# EAGLE design Caravan Tracker (EAGLE 7.3.0)
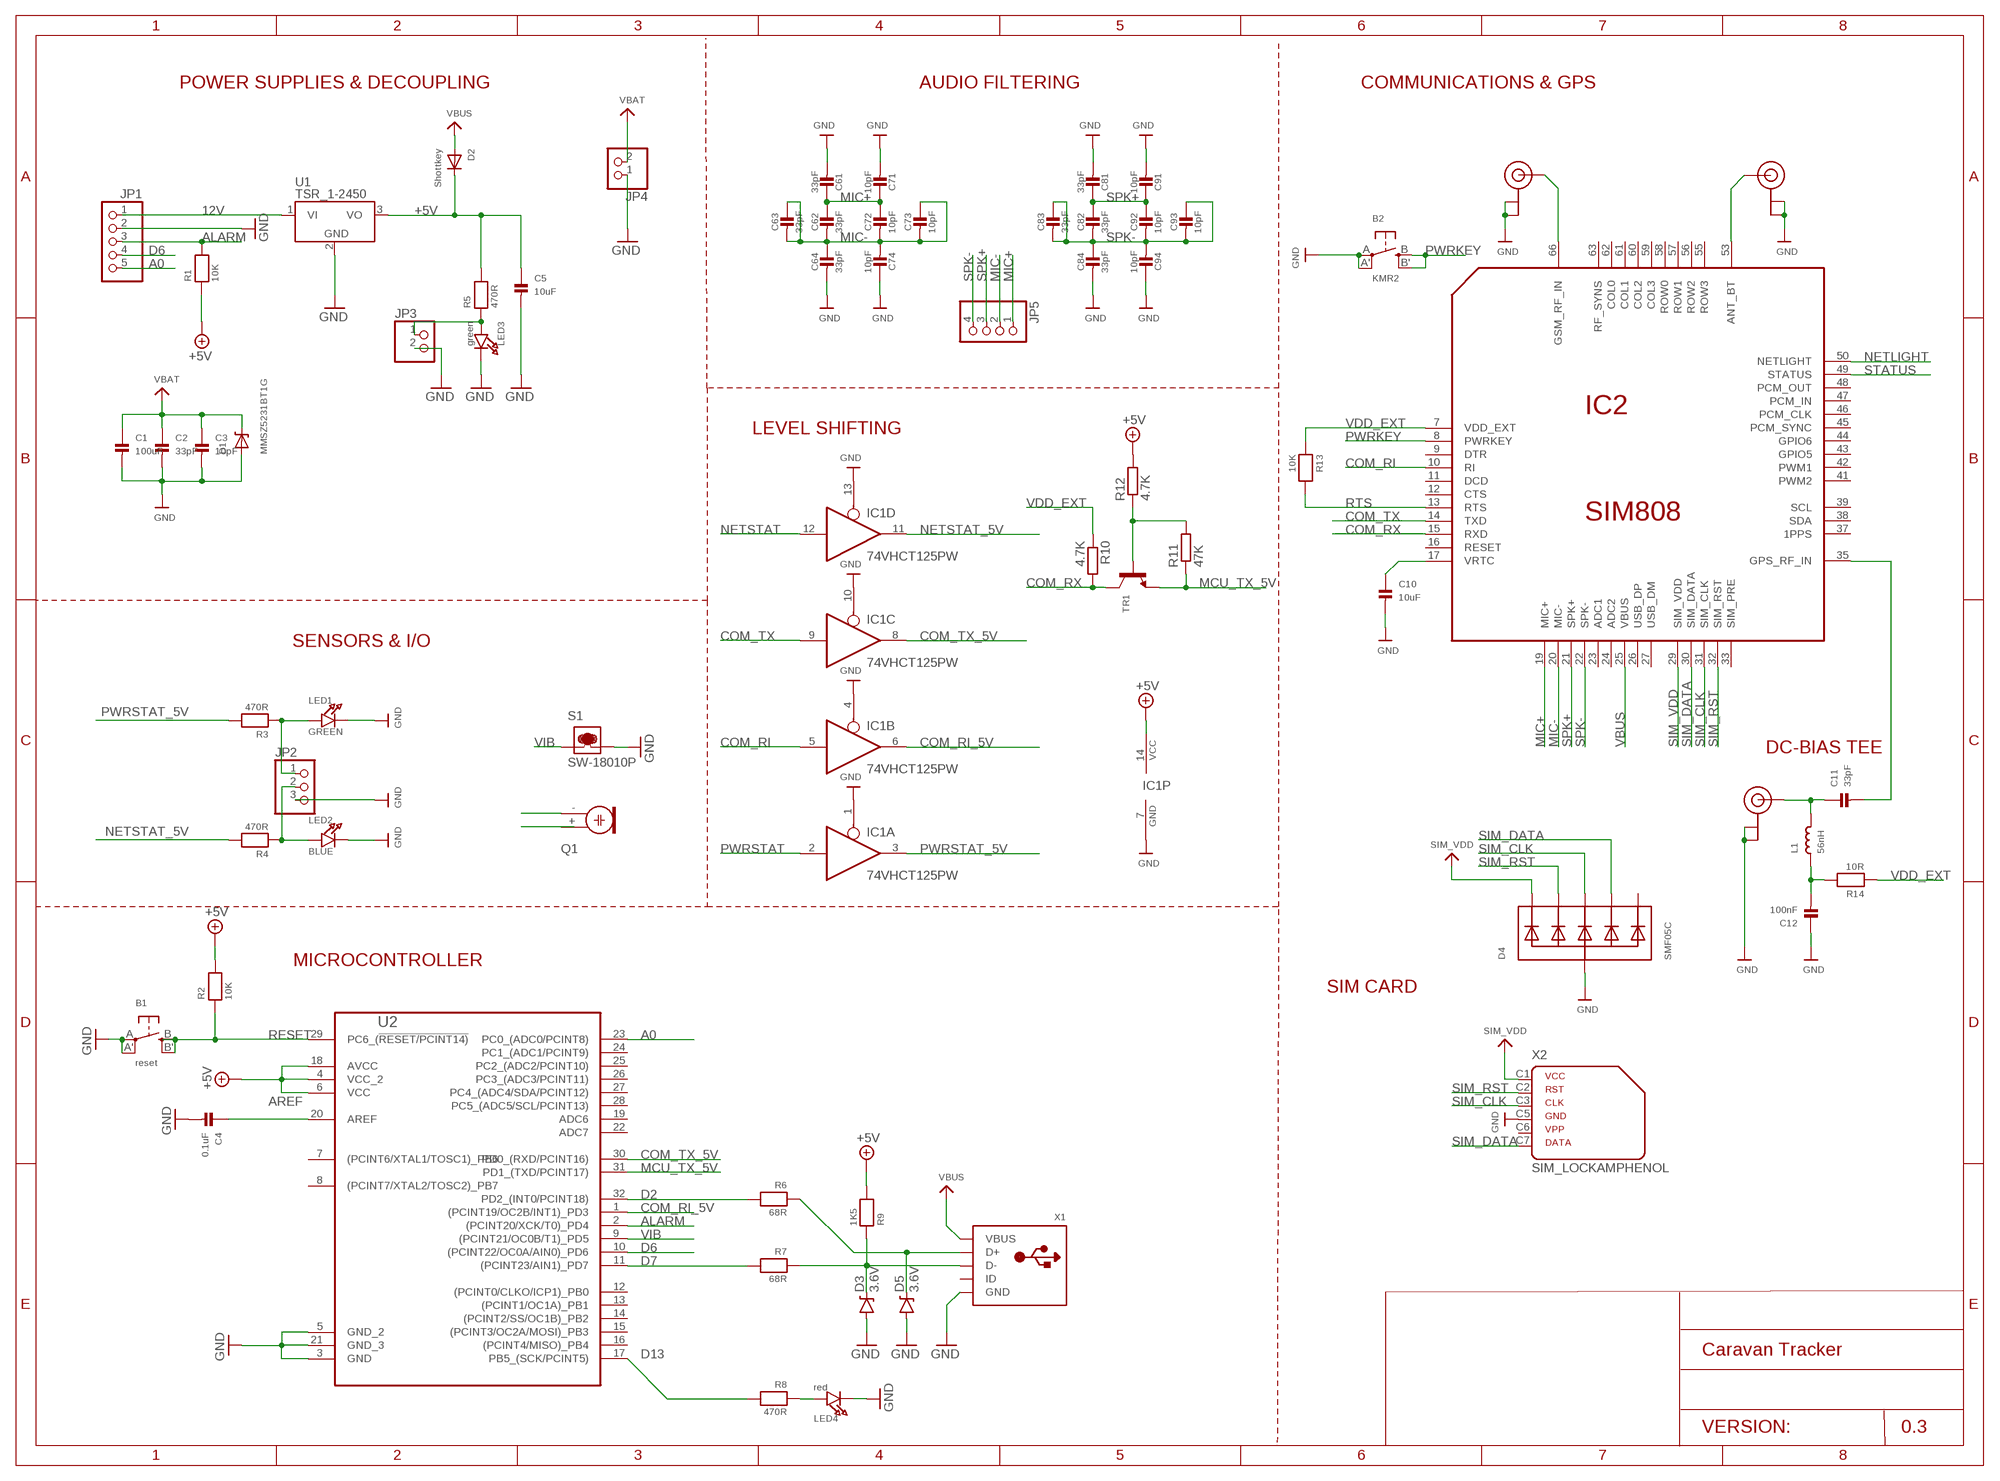
[diagram p0: schematic, sheet 1]

## Parts
B1  reset  SWITCH_TACT_SMT4.6X2.8  [BTN_KMR2_4.6X2.8]
B2  KMR2  SWITCH_TACT_SMT4.6X2.8  [BTN_KMR2_4.6X2.8]
C1  100uF  CAP_CERAMIC1206  [1206]
C2  33pF  CAP_CERAMIC0805  [0805]
C3  10pF  CAP_CERAMIC0805  [0805]
C4  0.1uF  CAP_CERAMIC0603  [0603]
C5  10uF  CAP_CERAMIC0603  [0603]
C6  33pF  CAP_4PACK1206  [RESPACK_4X0603]
C7  10pF  CAP_4PACK1206  [RESPACK_4X0603]
C8  33pF  CAP_4PACK1206  [RESPACK_4X0603]
C9  10pF  CAP_4PACK1206  [RESPACK_4X0603]
C10  10uF  CAP_CERAMIC0805  [0805]
C11  33pF  CAP_CERAMIC0805  [0805]
C12  100nF  CAP_CERAMIC0805  [0805]
D1  MMSZ5231BT1G  DIODE-ZENERSOD123  [SOD-123]
D2  Shottkey  DIODESOD-123  [SOD-123]
D3  3.6V  DIODE-ZENER3.3V  [SOD-323]
D4  SMF05C  TVSARRAY_5LANE  [SOT363]
D5  3.6V  DIODE-ZENER3.3V  [SOD-323]
IC1  74VHCT125PW  74ABT125PW  [TSSOP14]
IC2  SIM808  [SIM808]
JP1  HEADER-1X5ROUND  [1X05_ROUND]
JP2  HEADER-1X3ROUND  [1X03_ROUND]
JP3  HEADER-1X2ROUND  [1X02_ROUND]
JP4  JST_2PIN  [JSTPH2]
JP5  HEADER-1X4ROUND  [1X04_ROUND]
L1  56nH  INDUCTOR_0805  [_0805]
LED1  GREEN  LED0805_NOOUTLINE  [CHIPLED_0805_NOOUTLINE]
LED2  BLUE  LED0805_NOOUTLINE  [CHIPLED_0805_NOOUTLINE]
LED3  green  LED0805_NOOUTLINE  [CHIPLED_0805_NOOUTLINE]
LED4  red  LED0805_NOOUTLINE  [CHIPLED_0805_NOOUTLINE]
Q1  ELECTRET  [9.7ELECTRET]
R1  10K  RESISTOR0603  [0603]
R2  10K  RESISTOR0603  [0603]
R3  470R  RESISTOR0603  [0603]
R4  470R  RESISTOR0603  [0603]
R5  470R  RESISTOR0603  [0603]
R6  68R  RESISTOR0603  [0603]
R7  68R  RESISTOR0603  [0603]
R8  470R  RESISTOR0603  [0603]
R9  1K5  RESISTOR0603  [0603]
R10  4.7K  R-EU_R0603  [R0603]
R11  47K  R-EU_R0603  [R0603]
R12  4.7K  R-EU_R0603  [R0603]
R13  10K  RESISTOR0603  [0603]
R14  10R  RESISTOR_0805  [_0805]
S1  SW-18010P  [SW-18010P]
TR1  TRANSISTOR_NPN  [SOT23-R]
U1  TSR_1-2450  [TSR-1]
U2  ATMEGA328-AU  [QFP80P900X900X120-32N]
U$1  U.FL (GPS)  U.FL  [U.FL]
U$2  U.FL  [U.FL]
U$3  U.FL  [U.FL]
X1  USBMICRO_20329  [4UCONN_20329]
X2  SIM_LOCKAMPHENOL  [C707_10M006_512_2]

## Nets
12V [power]: JP1.1 U1.1(VI)
+5V [power]: C5.1 D2.C IC1.14(P:VCC) R1.1 R2.2 R5.2 R9.2 R12.2 U1.3(VO) U2.4(VCC_2) U2.6(VCC) U2.18(AVCC)
A0: JP1.5 U2.23(PC0_(ADC0/PCINT8))
ALARM: JP1.3 R1.2 U2.2((PCINT20/XCK/T0)_PD4)
ANT_BT: IC2.53(ANT_BT) U$3.3(SIGNAL)
AREF: C4.1 U2.20(AREF)
COM_RI: IC1.5(B:I) IC2.10(RI)
COM_RI_5V: IC1.6(B:O) U2.1((PCINT19/OC2B/INT1)_PD3)
COM_RX: IC2.15(RXD) R10.2 TR1.3(C)
COM_TX: IC1.9(C:I) IC2.14(TXD)
COM_TX_5V: IC1.8(C:O) U2.30(PD0_(RXD/PCINT16))
D2: R6.2 U2.32(PD2_(INT0/PCINT18))
D6: JP1.4 U2.10((PCINT22/OC0A/AIN0)_PD6)
D7: R7.2 U2.11((PCINT23/AIN1)_PD7)
D13: R8.2 U2.17(PB5_(SCK/PCINT5))
GND: B1.A'(P1) B1.A(P) B2.A'(P1) B2.A(P) C1.2 C2.2 C3.2 C4.2 C5.2 C6.5 C6.8 C7.4 C7.8 C8.5 C8.8 C9.4 C9.8 C10.2 C12.1 D1.A D3.A D4.2(A) D5.A IC1.1(A:OE) IC1.4(B:OE) IC1.7(P:GND) IC1.10(C:OE) IC1.13(D:OE) JP1.2 JP2.3 JP3.2 JP4.1 LED1.C LED2.C LED3.C LED4.C S1.1 U1.2(GND) U2.3(GND) U2.5(GND_2) U2.21(GND_3) U$1.1(GND) U$1.2(GND) U$2.1(GND) U$2.2(GND) U$3.1(GND) U$3.2(GND) X1.BASE@1(GND) X1.BASE@2(GND) X1.GND X1.SPRT@1(GND) X1.SPRT@2(GND) X1.SPRT@3(GND) X1.SPRT@4(GND) X2.C5
GSM_RF_IN: IC2.66(GSM_RF_IN) U$2.3(SIGNAL)
MCU_TX_5V: R11.1 TR1.2(E) U2.31(PD1_(TXD/PCINT17))
MIC+: C6.1 C6.2 C7.1 C7.2 IC2.19(MIC+) JP5.1
MIC-: C6.3 C6.4 C6.6 C6.7 C7.3 C7.5 C7.6 C7.7 IC2.20(MIC-) JP5.2 Q1.-
N$1: LED4.A R8.1
N$2: JP2.2 LED2.A R4.1
N$3: D5.C R6.1 X1.D+
N$4: JP2.1 LED1.A R3.1
N$5: D3.C R7.1 R9.1 X1.D-
N$6: JP3.1 LED3.A R5.1
N$7: C12.2 L1.1 R14.2
N$8: R11.2 R12.1 TR1.1(B)
N$9: C11.1 L1.2 U$1.3(SIGNAL)
N$10: C11.2 IC2.35(GPS_RF_IN)
N$11: C10.1 IC2.17(VRTC)
NETLIGHT: IC2.50(NETLIGHT)
NETSTAT: IC1.12(D:I)
NETSTAT_5V: IC1.11(D:O) R4.2
PWRKEY: B2.B'(S1) B2.B(S) IC2.8(PWRKEY)
PWRSTAT: IC1.2(A:I)
PWRSTAT_5V: IC1.3(A:O) R3.2
RESET: B1.B'(S1) B1.B(S) R2.1 U2.29(PC6_(!RESET/PCINT14))
RTS: IC2.13(RTS) R13.2
SIM_CLK: D4.4(C3) IC2.31(SIM_CLK) X2.C3
SIM_DATA: D4.5(C4) IC2.30(SIM_DATA) X2.C7
SIM_RST: D4.3(C2) IC2.32(SIM_RST) X2.C2
SIM_VDD [power]: D4.1(C1) IC2.29(SIM_VDD) X2.C1
SPK+: C8.1 C8.2 C9.1 C9.2 IC2.21(SPK+) JP5.3
SPK-: C8.3 C8.4 C8.6 C8.7 C9.3 C9.5 C9.6 C9.7 IC2.22(SPK-) JP5.4
STATUS: IC2.49(STATUS)
VBAT [power]: C1.1 C2.1 C3.1 D1.C JP4.2
VBUS [power]: D2.A IC2.25(VBUS) X1.VBUS
VDD_EXT [power]: IC2.7(VDD_EXT) R10.1 R13.1 R14.1
VIB: S1.2 U2.9((PCINT21/OC0B/T1)_PD5)
Unconnected: D4.6(C5) IC2.9(DTR) IC2.11(DCD) IC2.12(CTS) IC2.16(RESET) IC2.23(ADC1) IC2.24(ADC2) IC2.26(USB_DP) IC2.27(USB_DM) IC2.33(SIM_PRE) IC2.37(1PPS) IC2.38(SDA) IC2.39(SCL) IC2.41(PWM2) IC2.42(PWM1) IC2.43(GPIO5) IC2.44(GPIO6) IC2.45(PCM_SYNC) IC2.46(PCM_CLK) IC2.47(PCM_IN) IC2.48(PCM_OUT) IC2.55(ROW3) IC2.56(ROW2) IC2.57(ROW1) IC2.58(ROW0) IC2.59(COL3) IC2.60(COL2) IC2.61(COL1) IC2.62(COL0) IC2.63(RF_SYNS) Q1.+ U2.7((PCINT6/XTAL1/TOSC1)_PB6) U2.8((PCINT7/XTAL2/TOSC2)_PB7) U2.12((PCINT0/CLKO/ICP1)_PB0) U2.13((PCINT1/OC1A)_PB1) U2.14((PCINT2/SS/OC1B)_PB2) U2.15((PCINT3/OC2A/MOSI)_PB3) U2.16((PCINT4/MISO)_PB4) U2.19(ADC6) U2.22(ADC7) U2.24(PC1_(ADC1/PCINT9)) U2.25(PC2_(ADC2/PCINT10)) U2.26(PC3_(ADC3/PCINT11)) U2.27(PC4_(ADC4/SDA/PCINT12)) U2.28(PC5_(ADC5/SCL/PCINT13)) X1.ID X2.C6

## Notes on the sheet
- POWER SUPPLIES & DECOUPLING | AUDIO FILTERING | COMMUNICATIONS & GPS
- LEVEL SHIFTING
- SENSORS & I/O
- DC-BIAS TEE
- MICROCONTROLLER
- SIM CARD
- VERSION: | 0.3

## Power pins joined to a net without a drawn wire
GND: IC2.1(GND) IC2.2(GND) IC2.3(GND) IC2.18(GND) IC2.28(GND) IC2.34(GND) IC2.36(GND) IC2.40(GND) IC2.51(GND) IC2.52(GND) IC2.54(GND) IC2.64(GND) IC2.65(GND) IC2.67(GND) IC2.68(GND)
VBAT: IC2.4(VBAT) IC2.5(VBAT) IC2.6(VBAT)

## Library data of the parts
B1 B2 = microbuilder:SWITCH_TACT_SMT: SMT Tact Switches 6x6mm - Digikey: P12940SCT-ND KMR2 (4.6x2.8mm) - Digikey: 401-1426-1-ND EVQ-PQHB55 - Light Touch, 160GF (4.5x4.5mm) - Digikey: P8090SCT-ND
C1-C5 C10-C12 = microbuilder:CAP_CERAMIC: Ceramic Capacitors 0402 - 0402 Surface Mount Capacitors 16pF 50V 5% [Digikey: 445-4899-2-ND] 18pF 50V 5% [Digikey: 490-1281-2-ND] 22pF 50V 5% [Digikey: 490-1283-2-ND] 68pF 50V 5% [Digikey: 490-1289-2-ND] 0.1uF 10V 10% [Digikey: 490-1318-2-ND] 1.0uF 6.3V 10% [Digikey: 490-1320-2-ND] 0603 - 0603 Surface Mount Capacitors 16 pF 50V 5% [Digikey: 445-5051-2-ND] 22 pF 50V [Digikey: PCC220ACVTR-ND] 33 pF 50V 5% [Digikey: 490-1415-1-ND] 56pF 50V 5% [Digikey: 490-1421-1-ND] 220pF 50V 5% [Digikey: 445-1285-1-ND] 680 pF 50V 2200 pF 50V 5% C0G [Digikey: 445-1297-1-ND] 5600 pF 100V 5% X7R [Digikey: 478-3711-1-ND] 0.1 µF 25V 10% [Digikey: PCC2277TR-ND] 0.22 µF 16V 10% X7R [Digikey: 445-1318-1-ND] 1.0 µF 25V 10% [Digikey: 445-5146-2-ND] 0603 - RF Specific 3pF 250V +/-0.1pF RF [Digikey: 712-1347-1-ND] 18 pF 250V 5% [Digikey: 478-3505-1-ND or 712-1322-1-ND] 56 pF 250V 5% C0G RF [Digikey: 490-4867-1-ND] 68 pF 250V RF [Digikey: 490-4868-1-ND] 0805 - 0805 Surface Mount Capacitors 220 pF 250V 2% RF Ceramic Capacitor [Digikey: 712-1398-1-ND] 1000 pF 50V 2% NP0 Ceramic Capacitor [Digikey: 478-3760-1-ND] 0.1 µF 25V 10% Ceramic Capacitor [Digikey: PCC1828TR-ND] 1.0 µF 16V 10% Ceramic Capacitor[Digikey: 490-1691-2-ND] 10.0 µF 10V 10% Ceramic Capacitor[Digikey: 709-1228-1-ND] 10.0 uF 16V 10% Ceramic Capacitor [Digikey: 478-5165-2-ND] 47 uF 6.3V 20% Ceramic Capacitor [Digikey: 587-1779-1-ND or 399-5506-1-ND] 1206 - 1206 Surface Mount Capacitors 47uF 10V 20% Ceramic Capacitor [Digikey: 490-5528-1-ND or 399-5508-1-ND or 445-6010-1-ND] 100uF 6.3V -20%, +80% Y5V Ceramic Capacitor (Digikey: 490-4512-1-ND, Mouser: 81-GRM31CF50J107ZE1L)
C6-C9 = microbuilder:CAP_4PACK
D1 = Adafruit-FONA-800-GSM-Breakout:DIODE-ZENER: Zener Diode
D2 = microbuilder:DIODE: Diode SMA Model Volts Amps Type Vf Vr Digikey # Notes SSA34-E3 40V 3A Schottky 480mV @ 3A 200uA @ 40V SSA34-E3/61TGITR-ND CDBA120-G 20V 1A Schottky 500mV @ 1A 500uA @ 20V 641-1014-6-ND REEL MBRA210 10V 2A Schottky 350mV @ 2A 700uA @ 10V MBRA210LT3 SOD-123 Model Volts Amps Type Vf Vr Order # Notes BAT54T1G 30V 200mA Schottky 800mV @ 200mA 2uA @ 25V BAT54T1GOSTR-ND B0530W 30V 500mA Schottky 430mV @ 500mA 130uA @ 30V B0530W-FDICT-ND REEL MBR120 1A 20V Schottky 340mV @ 1A MBR120VLSFT1GOSCT-ND SOD-323 Model Volts Amps Type Vf Vr Order # Notes PMEG2005EJ 20V 500mA Schottky 355mV @ 500mA 568-4110-1-ND ZLLS410 10V 570mA Schottky 380mV @ 570mA ZLLS410CT-ND 1N4148WS 75V 150mA Silicon/Simple 1V 1N4148WSFSCT-ND REEL SOD-523 Model Volts Amps Type Vf Vr Order # Notes BAT54XV2 30V 200mA Schottky 0.8V @ 100mA BAT54XV2CT-ND TB751S 30V 30mA Schottky RB751S-40TE61CT-ND SOT23-R/W (R = Solder Paste/Reflow Ovens, W = Hand-Soldering) Model Volts Amps Type Vf Vr Order # Notes BAT54FILM 40V 300mA Schottky 497-7162-1-ND
D3 D5 = SparkFun-DiscreteSemi:DIODE-ZENER: Zener Diode; PROD_ID: DIO-11284; VALUE: 3.3V
D4 = microbuilder:TVSARRAY_5LANE: Voltage Transient Suppressor Array SOT363 SMF05C - 100W 5V: Digikey - SMF05CT1GOSCT-ND
IC1 = 74xx-us:74*125: Quad bus BUFFER, 3-state
IC2 = sim808:SIM808
JP1 = microbuilder:HEADER-1X5: PIN HEADER
JP2 = microbuilder:HEADER-1X3: PIN HEADER
JP3 = microbuilder:HEADER-1X2: PIN HEADER
JP4 = microbuilder:JST_2PIN: JST 2-Pin Right-Angle Connector PH-Series - 4UConnector: 17311 SH-Series - 4UConnector: 07278
JP5 = microbuilder:HEADER-1X4: PIN HEADER
L1 = microbuilder:INDUCTOR: Inductors 0603: 10nH Ceramic Inductor - microwire antenna/RF (Digikey: 712-1434-2-ND) 0805: 560nH Ceramic Inductor - RF (Digikey: 553-1047-1-ND) 270nH Ceramic Inductor - Q = 40@250MHz, +-5%, 1 Ohm DC Resistance (Digikey: 535-10506-2-ND) 1007 (2518 Metric) SMT: 10µH 10% 250mOhm 820mA 1007 Inductor (Digikey: 587-2189-1-ND) 22µH 10% 500mOhm 580mA 1007 Inductor (Digikey: 587-2190-1-ND) 47µH 10% 950mOhm 420mA 1007 Inductor (Digikey: 587-2191-1-ND) 47µH 5% 100mOhm 1A 1008 Inductor (Digikey: 732-1816-1-ND) 5.0x5.0mm (Taiyo Yuden NR5040 Series) 6.8µH 20% 2.3A 64mOhm Inductor (Digikey: 587-2374-2-ND) 5.0x5.0mm (TDK VLC5045 Series) 4.7µH 20% 3.3A 34mOhm Inductor (Digikey: 445-6526-1-ND) 6.8µH 20% 2.7A 46mOhm Inductor (Digikey: 445-6527-1-ND) 6.0x6.0mm (TDK VLC6045 Series) 4.7µH 20% 3.8A 27mOhm Inductor (Digikey: 445-6538-2-ND) 6.8µH 20% 3A 41mOhm Inductor (Digikey: 445-6540-1-ND) 6.2µH 30% 2.2A 45mOhm Inductor (Digikey: SRR5028-6R2YCT-ND) - Not TDK VLC6045 but footprint should match 6.0x6.0mm (TDK SLF6045 Series) 6.8uH 30% 2A 33mOhm Inductor (Digikey: 445-4572-1-ND, Mouser: 810-SLF645T6R8N2R0PF)
LED1-LED4 = microbuilder:LED: LED 0603 - 0603 Surface Mount Package 2mA: Green LED - Low Power (3.9mcd, 2ma, 1.7Vf) - Digikey: 475-2709-2-ND Orange LED - Low Power (9.8mcd, 2ma, 1.8Vf) - Digikey: 475-1194-2-ND Red LED - Low Power (5mcd, 2ma, 1.8Vf) - Digikey: 475-1195-2-ND Yellow LED - Low Power (7mcd, 2ma, 1.8Vf) - Digikey: 475-1196-2-ND 5mA: Blue LED - Low Power (17mcd, 5ma, 2.9Vf) - Digikey: LNJ937W8CRACT-ND 0805 - 0805 Surface Mount Package 2mA: Red LED (8.8mcd, 2mA, 1.8Vf, Clear) - Low Power [Digikey: 475-2510-1-ND] Green LED (5mcd, 2mA, 1.8Vf, Clear) - Low Power [Digikey: 475-2730-1-ND] Yellow LED (11.3mcd, 2mA, 1.8Vf, Clear) - Low Power [Digikey: 475-2555-1-ND] 20mA: Red LED (104mcd, 20mA, Diffused) - LS R976 [Digikey: 475-1278-6-ND] Red LED (12mcd, 20mA, 2.0Vf, Clear) - APT2012EC [Digikey: 754-1128-1-ND] Green LED (15mcd, 20mA, 2.2Vf, Clear) - APT2012GC [Digikey: 754-1131-1-ND] Orange LED (160mcd, 20mA, 2.1Vf, Clear) - APT2012SECK [Digikey: 754-1130-1-ND] 1206 - 1206 Surface Mount Package Green LED (26mcd, 20mA, Diffused) - LG N971 [Digikey: 475-1407-6-ND] Red LED (15mcd, 20mA, Diffused) - LH N974 [Digikey: 475-1416-6-ND]
Q1 = Caravan Tracker:ELECTRET: Electret microphone Thru hole 2.54mm spacing with 9.7mm diameter
R1-R9 R13 R14 = microbuilder:RESISTOR: Resistors 0402 - 0402 Surface Mount Package 22 Ohm 1% 1/16W [Digikey: 311-22.0LRTR-ND] 33 Ohm 5% 1/16W 1.0K 5% 1/16W 1.5K 5% 1/16W 2.0K 1% 1/16W 10.0K 1% 1/16W [Digikey: 311-10.0KLRTR-ND] 10.0K 5% 1/16W [Digikey: RMCF0402JT10K0TR-ND] 12.1K 1% 1/16W [Digikey: 311-22.0LRTR-ND] 100.0K 5% 1/16W 0603 - 0603 Surface Mount Package 0 Ohm 1/10 Watt 1% Resistor 15 Ohm 1/10 Watt 1% Resistor 33 Ohm 1/10 Watt 1% Resistor 49.9 Ohm 1/10 Watt 1% Resistor 100 Ohm 1/10 Watt 1% Resistor 150 Ohm 1/10 Watt 1% Resistor 240 Ohm 1/10 Watt 1% Resistor 390 Ohm 1/10 Watt 1% Resistor 560 Ohm 1/10 Watt 1% Resistor 680 Ohm 1/10 Watt 1% Resistor 750 Ohm 1/10 Watt 1% Resistor 1.0K Ohm 1/10 Watt 1% Resistor 1.5K Ohm 1/10 Watt 1% Resistor 2.0K Ohm 1/10 Watt 1% Resistor 2.2K Ohm 1/10 Watt 1% Resistor 3.3K Ohm 1/10 Watt 1% Resistor 4.7K Ohm 1/10 Watt 1% Resistor 10.0K Ohm 1/10 Watt 1% Resistor 12.0K Ohm 1/10 Watt 1% Resistor 12.1K Ohm 1/10 Watt 1% Resistor 20.0K Ohm 1/10 Watt 1% Resistor 33.0K Ohm 1/10 Watt 1% Resistor 100.0K Ohm 1/10 Watt 1% Resistor 0805 - 0805 Surface Mount Package 0 Ohm 1/8 Watt 1% Resistor 33 Ohm 1/8 Watt 1% Resistor 100 Ohm 1/8 Watt 1% Resistor 150 Ohm 1/8 Watt 1% Resistor 200 Ohm 1/8 Watt 1% Resistor 240 Ohm 1/8 Watt 1% Resistor 330 Ohm 1/8 Watt 1% Resistor 390 Ohm 1/8 Watt 1% Resistor 470 Ohm 1/8 Watt 1% Resistor 1.0K Ohm 1/8 Watt 1% Resistor 1.5K Ohm 1/8 Watt 1% Resistor 2.0K Ohm 1/8 Watt 1% Resistor 4.7K Ohm 1/8 Watt 1% Resistor 5.1K Ohm 1/8 Watt 1% Resistor 5.6K Ohm 1/8 Watt 1% Resistor 10.0K Ohm 1/8 Watt 1% Resistor 22.0K Ohm 1/8 Watt 1% Resistor 33.0K Ohm 1/8 Watt 1% Resistor 100K Ohm 1/8 Watt 1% Resistor 1206 - 1206 Surface Mount Package 2012 - 2010 Surface Mount Package 0.11 Ohm 1/2 Watt 1% Resistor - Digikey: RHM.11UCT-ND
R10-R12 = resistor:R-EU_: RESISTOR, European symbol
S1 = Caravan Tracker:SW-18010P
TR1 = microbuilder:TRANSISTOR_NPN: NPN Transistor Transistor (NPN) 500mA 45V - BC817 [Digikey: 568-1631-1-ND] Transistor (NPN) 500mA 45V - BC817,215 [Mouser: 771-BC817-T/R] SOT23-R - SOT23 footprint optimised for use with solder paste and reflow ovens. SOT23-W - SOT23 footprint optimised for hand-soldering (larger pads).
U1 = _traco_tsr-1:TSR_1-*: TRACO TSR-1 Series Point-of-Load DC/DC-Converters Vi max. 36 V; Vo = (1.2 .. 15)V ±2%; Io = 0 .. 1 A SIP-Package (drop-in replacement for 78xx linear voltage regulators in TO220-package, vertically assembled) Source: www.tracopower.com Technologies: TSR 1- Vi (V) Vo (V) ±2% Io = 0 .. 1 A 24_ ( generic ) 2412 4.6 .. 36 1.2 2415 4.6 .. 36 1.5 2418 4.6 .. 36 1.8 2425 4.6 .. 36 2.5 2433 4.75.. 36 3.3 2450 6.5 .. 36 5.0 2465 9.0 .. 36 6.5 2490 12 .. 36 9.0 24120 15 .. 36 12 24150 18 .. 36 15 Author: Dipl.-Ing. FH Rainer Bayer HHN Hochschule Heilbronn, rainer.bayer@hs-heilbronn.de Ingenieurbüro ing-rb, mail@ing-rb.de
U2 = ATMEGA328-AU:ATMEGA328-AU: MCU, 8BIT, AVR, 32K FLASH, TQFP-32; MPN: ATMEGA328-AU; OC_FARNELL: 1972086; OC_NEWARK: 68T2926; PACKAGE: TQFP-32; SUPPLIER: ATMEL
U$1-U$3 = microbuilder:U.FL: U.FL Antenna Connector
X1 = usb:USB: USB Connectors USBMINIB - Surface Mount Female Mini-B USB Connector 4UConnector: 06564
X2 = microbuilder:SIM_LOCK: C707A SIMLOCK® 2.5 mm with wide solder tails Source: Data sheet <http://www.amphenol.info/downloads/C707_10M006_512_2.pdf>; OC_FARNELL: unknown; OC_NEWARK: unknown

## Net classes
1 power: width 0.356 mm

## Board
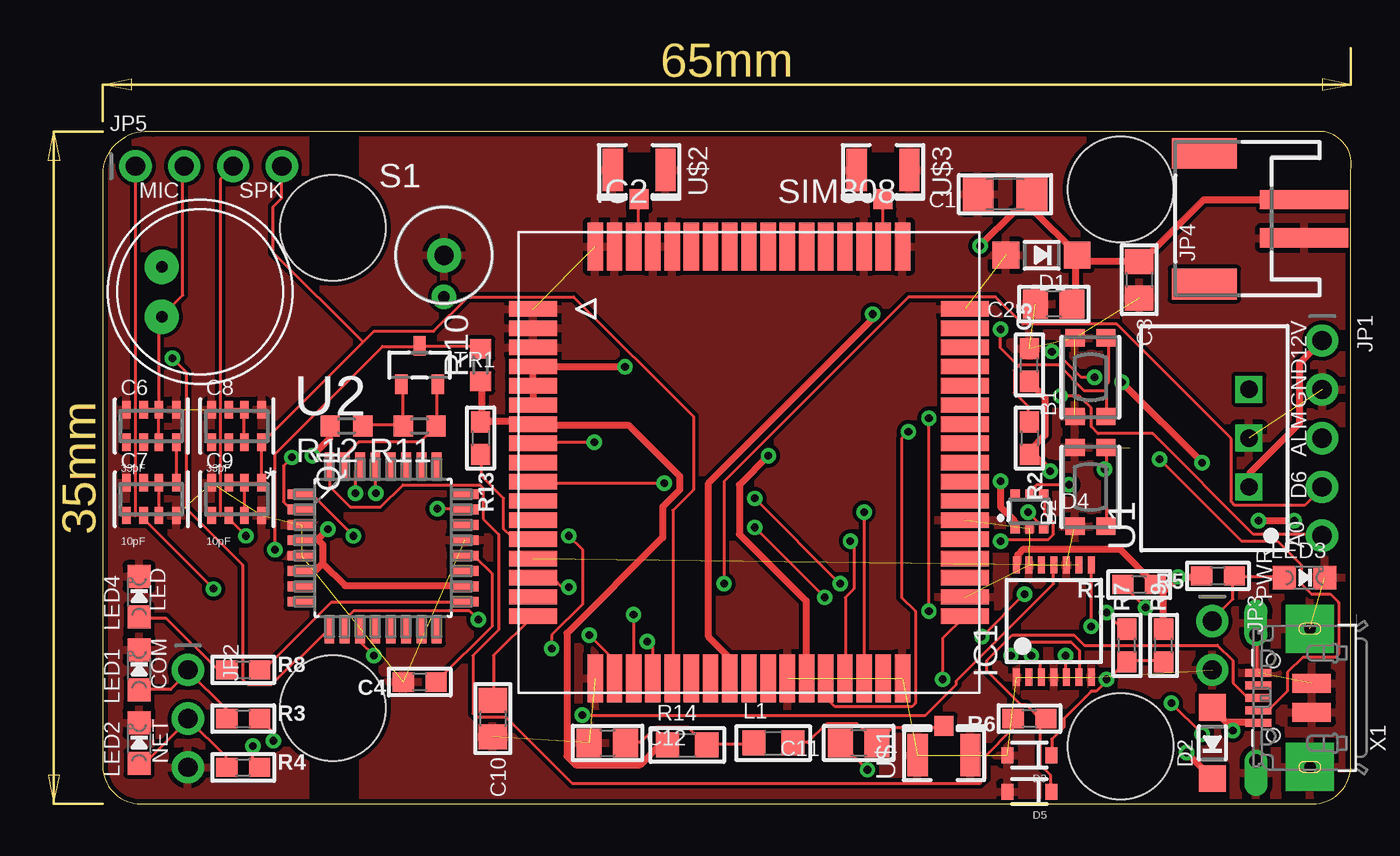
[diagram p1: board, top side]
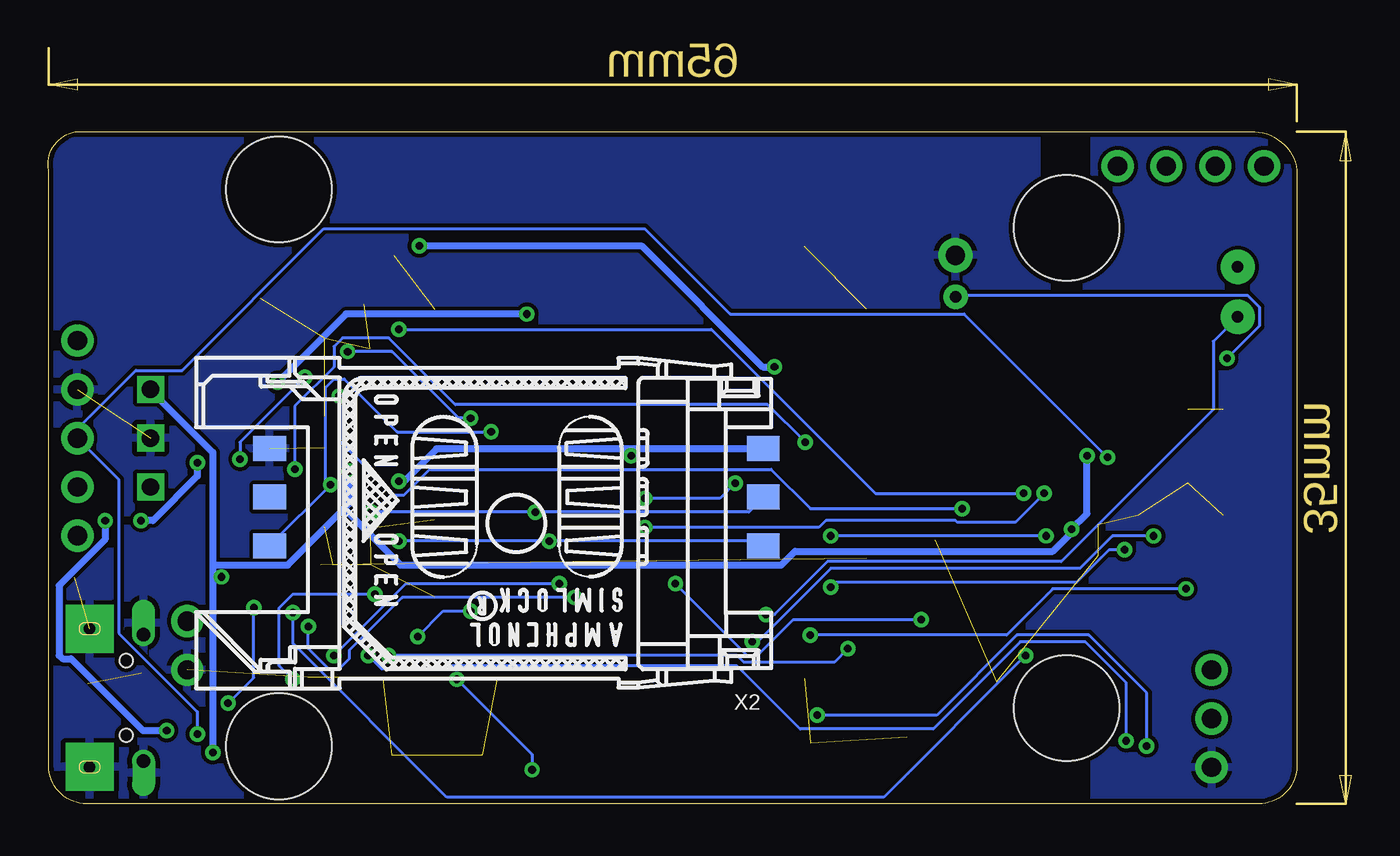
[diagram p2: board, bottom side, seen from below]

Size 65.03 x 35.02 mm. Coordinates in mm from the lower left corner, seen from the top.
Outline: 65,2 65,33 arc90 63.63,35 2.63,35 arc90 0,33 0,2 arc90 2,0 63,0 arc90 65,2
Copper layers (1*16): Top 0.035mm / dielectric 1.5mm / Bottom 0.035mm
Design rules "adafruit *": minimum track width 6mil, minimum drill 15.5mil, track to track 8mil, track to pad 5mil, pad to pad 8mil, via to via 8mil, smd to smd 8mil, copper to edge 10mil, drill to drill 8mil, minimum pad ring 10mil, minimum via ring 8mil, stop-mask expansion 2mil, vias tented up to drill 20mil, thermal gap 10mil
Holes 5.5 mm at 12,5 53,3 53,32 12,30
tKeepout: area 51,30 to 55,34; area 51,1 to 55,5; area 10.8,32.4 to 13.3,34.9; area 10.8,0 to 13.3,2.5
bKeepout: area 10.8,32.4 to 13.3,34.9; area 10.8,0 to 13.3,2.5
tRestrict: area 10.8,32.4 to 13.3,34.9; area 10.8,0 to 13.3,2.5
bRestrict: area 10.8,32.4 to 13.3,34.9; area 10.8,0 to 13.3,2.5
vRestrict: area 10.8,32.4 to 13.3,34.9; area 10.8,0 to 13.3,2.5

### Footprints (pad centres in the part's own frame; a part is rotated, then mirrored left to right if it is on the bottom)
BTN_KMR2_4.6X2.8 = smd 0.9 x 1: A 2.05,0.8; A' -2.05,0.8; B 2.05,-0.8; B' -2.05,-0.8
1206 = smd 1.6 x 1.8: 1 -1.4,0; 2 1.4,0
0805 = smd 1.3 x 1.5: 1 -0.95,0; 2 0.95,0
0603 = smd 1.1 x 1: 1 -0.85,0; 2 0.85,0
RESPACK_4X0603 = smd 0.45 x 0.9: 1 -1.3,-0.85; 2 -0.4,-0.85; 3 0.4,-0.85; 4 1.3,-0.85; 5 1.3,0.85; 6 0.4,0.85; 7 -0.4,0.85; 8 -1.3,0.85
SOD-123 = smd 1.4 x 1.4: A 1.85,0; C -1.85,0
SOD-323 = smd 0.63 x 0.83: A 1.15,0; C -1.15,0
SOT363 = smd 0.5 x 0.5: 1 -0.75,-0.9; 3 0.75,-0.9; 4 0.75,0.9; 6 -0.75,0.9 | smd 0.4 x 0.5: 2 0,-0.9; 5 0,0.9
TSSOP14 = smd 0.35 x 0.9: 1 -1.95,-2.925; 2 -1.3,-2.925; 3 -0.65,-2.925; 4 0,-2.925; 5 0.65,-2.925; 6 1.3,-2.925; 7 1.95,-2.925; 8 1.95,2.925; 9 1.3,2.925; 10 0.65,2.925; 11 0,2.925; 12 -0.65,2.925; 13 -1.3,2.925; 14 -1.95,2.925
SIM808 = smd 2.5 x 0.8: 1 -11.25,8; 2 -11.25,7; 3 -11.25,6; 4 -11.25,5; 5 -11.25,4; 6 -11.25,3; 7 -11.25,2; 8 -11.25,1; 9 -11.25,0; 10 -11.25,-1; 11 -11.25,-2; 12 -11.25,-3; 13 -11.25,-4; 14 -11.25,-5; 15 -11.25,-6; 16 -11.25,-7; 17 -11.25,-8; 35 11.25,-8; 36 11.25,-7; 37 11.25,-6; 38 11.25,-5; 39 11.25,-4; 40 11.25,-3; 41 11.25,-2; 42 11.25,-1; 43 11.25,0; 44 11.25,1; 45 11.25,2; 46 11.25,3; 47 11.25,4; 48 11.25,5; 49 11.25,6; 50 11.25,7; 51 11.25,8 | smd 0.8 x 2.5: 18 -8,-11.25; 19 -7,-11.25; 20 -6,-11.25; 21 -5,-11.25; 22 -4,-11.25; 23 -3,-11.25; 24 -2,-11.25; 25 -1,-11.25; 26 0,-11.25; 27 1,-11.25; 28 2,-11.25; 29 3,-11.25; 30 4,-11.25; 31 5,-11.25; 32 6,-11.25; 33 7,-11.25; 34 8,-11.25; 52 8,11.25; 53 7,11.25; 54 6,11.25; 55 5,11.25; 56 4,11.25; 57 3,11.25; 58 2,11.25; 59 1,11.25; 60 0,11.25; 61 -1,11.25; 62 -2,11.25; 63 -3,11.25; 64 -4,11.25; 65 -5,11.25; 66 -6,11.25; 67 -7,11.25; 68 -8,11.25
1X05_ROUND = drill 1 pad 1.676: 1 -5.08,0; 2 -2.54,0; 3 0,0; 4 2.54,0; 5 5.08,0
1X03_ROUND = drill 1 pad 1.676: 1 -2.54,0; 2 0,0; 3 2.54,0
1X02_ROUND = drill 1 pad 1.676: 1 -1.27,0; 2 1.27,0
JSTPH2 = smd 1 x 4.6: 1 -1,-3.7; 2 1,-3.7 | smd 1.6 x 3.4: NC1 -3.4,1.5; NC2 3.4,1.5
1X04_ROUND = drill 1 pad 1.676: 1 -3.81,0; 2 -1.27,0; 3 1.27,0; 4 3.81,0
_0805 = smd 1.2 x 1.3: 1 -1.016,0; 2 1.016,0
CHIPLED_0805_NOOUTLINE = smd 1.2 x 1.2: A 0,-1.05; C 0,1.05
9.7ELECTRET = drill 0.6 pad 1.778: + 1.3,2; - -1.3,2
R0603 = smd 1 x 1.1: 1 -0.85,0; 2 0.85,0
SW-18010P = drill 1 pad 1.778: 1 0,0 | drill 0.6 pad 1.27: 2 0,-2.16
SOT23-R = smd 0.635 x 1.016: 1 -0.95,-1; 2 0.95,-1; 3 0,1
TSR-1 = drill 0.9 square: 1 -2.54,0; 2 0,0; 3 2.54,0
QFP80P900X900X120-32N = smd 1.473 x 0.508: 1 -4.242,2.794; 2 -4.242,2.007; 3 -4.242,1.194; 4 -4.242,0.406; 5 -4.242,-0.406; 6 -4.242,-1.194; 7 -4.242,-2.007; 8 -4.242,-2.794; 17 4.242,-2.794; 18 4.242,-2.007; 19 4.242,-1.194; 20 4.242,-0.406; 21 4.242,0.406; 22 4.242,1.194; 23 4.242,2.007; 24 4.242,2.794 | smd 0.508 x 1.473: 9 -2.794,-4.242; 10 -2.007,-4.242; 11 -1.194,-4.242; 12 -0.406,-4.242; 13 0.406,-4.242; 14 1.194,-4.242; 15 2.007,-4.242; 16 2.794,-4.242; 25 2.794,4.242; 26 2.007,4.242; 27 1.194,4.242; 28 0.406,4.242; 29 -0.406,4.242; 30 -1.194,4.242; 31 -2.007,4.242; 32 -2.794,4.242
U.FL = smd 2.2 x 1.05: 1 0,1.375; 2 0,-1.375 | smd 1.05 x 1: 3 1.525,0
4UCONN_20329 = smd 1 x 2: BASE@1 -0.75,-2; BASE@2 0.75,-2 | smd 0.4 x 1.35: D+ 0,0.775; D- -0.65,0.775; GND 1.3,0.775; ID 0.65,0.775; VBUS -1.3,0.775 | drill 0.7 offset: SPRT@1 -3.3,0.9; SPRT@2 3.3,0.9 | drill 0.6 pad 2.5 square: SPRT@3 -3.6,-1.9; SPRT@4 3.6,-1.9 | hole 0.7: -1.95,0; 1.95,0
C707_10M006_512_2 = smd 1.7 x 1.3: C1 -12.85,-3.915; C2 -12.85,-1.375; C3 -12.85,1.165; C5 12.85,-3.915; C6 12.85,-1.375; C7 12.85,1.165

### Placement (x,y rotation side)
B1  51.44,22.23 90 top
B2  51.44,16.51 90 top
C1  46.99,31.75 180 top
C2  49.53,26.04 180 top
C3  53.98,27.3 270 top
C4  16.51,6.35 180 top
C5  48.26,22.86 90 top
C6  2.54,19.68 0 top
C7  2.54,15.88 0 top
C8  6.99,19.68 0 top
C9  6.99,15.88 0 top
C10  20.32,4.45 270 top
C11  39.37,3.17 180 top
C12  26.29,3.17 0 top
D1  48.9,28.57 180 top
D2  57.78,3.17 90 top
D3  48.26,2.54 180 top
D4  48.26,15.24 0 top
D5  48.26,0.64 180 top
IC1  49.53,9.53 0 top
IC2  33.66,17.78 0 top
JP1  63.5,19.05 270 top
JP2  4.45,4.45 270 top
JP3  57.78,8.26 270 top
JP4  58.86,30.48 90 top
JP5  5.52,33.21 0 top
L1  34.92,3.17 0 top
LED1  1.91,6.99 0 top
LED2  1.91,3.17 0 top
LED3  62.59,11.79 270 top
LED4  1.91,10.79 0 top
Q1  5.08,26.67 90 top
R1  53.98,11.43 180 top
R2  48.26,19.05 270 top
R3  7.33,4.45 0 top
R4  7.33,1.91 0 top
R5  58.08,11.87 180 top
R6  48.26,4.45 180 top
R7  53.34,8.26 90 top
R8  7.33,6.99 0 top
R9  55.24,8.26 90 top
R10  19.68,22.86 90 top
R11  16.51,19.68 180 top
R12  12.7,19.68 180 top
R13  19.68,19.05 270 top
R14  30.44,3.07 0 top
S1  17.78,28.57 0 top
TR1  16.51,22.86 0 top
U1  59.69,19.05 90 top
U2  14.61,13.34 0 top
U$1  43.81,2.54 90 top
U$2  27.94,33.02 270 top
U$3  40.64,33.02 270 top
X1  60.96,5.52 90 top
X2  40.64,14.61 180 bottom

### Tracks (layer width: path | path; a pad name or v marks a point on that pad's centre or on a via)
12V
  Top 0.356: U1.1 59.74,16.54 59.74,17.25 62.32,19.82 62.32,22.94 63.48,24.09 JP1.1
+5V  (via drill 0.39)
  Top 0.356: v10.94,18.14 11.82,19.02 11.82,19.65 R12.2 | 11.2,13.78 v11.73,14.31 | 11.2,13.78 10.4,13.78 U2.4 | 11.47,12.54 11.11,12.18 10.4,12.18 U2.6 | 11.47,12.54 11.47,13.51 11.2,13.78 | 11.47,12.54 12.62,11.38 18.85,11.38 U2.18 | IC1.14 47.65,12.54 47.65,12.98 47.92,13.25 52.98,13.25 54.76,11.47 R1.1 | R9.2 55.21,9.16 55.21,11.02 54.94,11.29 R1.1 | R5.2 57.16,11.82 v56.01,11.82 55.3,11.11 R1.1 | C5.1 48.27,21.96 49.07,21.16 49.07,19.2 48.27,18.4 48.27,18.22 R2.2 48.45,18.22 v49.34,17.34 | v56.45,2.67 57.78,1.33 D2.C
  Bottom 0.356: v10.94,18.14 10.94,15.11 v11.73,14.31 11.82,14.22 11.82,14.05 12.71,13.16 26.14,13.16 26.85,12.45 46.67,12.45 49.61,15.38 | 56.45,12.45 56.45,18.31 59.65,21.51 U1.3 | 56.45,12.45 56.45,11.82 | 56.45,11.82 v56.45,2.67 | v49.34,17.34 49.34,15.65 49.61,15.38 | 49.61,15.38 52.54,12.45 56.45,12.45 | 56.45,11.82 v56.01,11.82
A0  (via drill 0.39)
  Top 0.152: v17.42,15.38 18.85,15.38 U2.23 | v49.87,21.25 50.85,21.25 51.47,20.62 51.47,19.65 51.83,19.29 54.67,19.29 59.92,14.05 63.48,14.05 JP1.5
  Bottom 0.152: v17.42,15.38 25.34,15.38 27.38,17.42 45.16,17.42 46.49,16.09 47.03,16.09 49.87,18.94 v49.87,21.25
ALARM  (via drill 0.39)
  Top 0.152: v54.32,10.22 53.16,11.38 R1.2 | v57.25,3.65 v55.65,5.25 | v9.87,18.05 9.42,17.6 9.42,15.73 9.78,15.38 10.31,15.38 U2.2
  Bottom 0.152: v54.32,10.22 54.32,6.58 v55.65,5.25 | v57.25,3.65 57.25,4.8 61.34,8.89 61.34,16.89 JP1.3 63.48,19.11 63.48,19.56 60.45,22.58 58.05,22.58 50.67,29.96 33.96,29.96 29.52,25.51 17.34,25.51 v9.87,18.05
ANT_BT
  Top 0.152: U$3.3 40.63,31.47 40.63,29.07 IC2.53
AREF
  Top 0.152: C4.1 17.42,6.4 20.27,9.25 20.27,12 19.38,12.89 18.85,12.89 U2.20
COM_RI  (via drill 0.39)
  Top 0.152: v50.14,7.73 50.14,6.67 IC1.5 | v33.96,15.91 v38.41,11.47 | v29.25,16.71 22.49,16.71 IC2.10
  Bottom 0.152: v50.14,7.73 46.41,11.47 v38.41,11.47 | v33.96,15.91 30.05,15.91 v29.25,16.71
COM_RI_5V  (via drill 0.39)
  Top 0.152: v47.3,7.73 48.01,8.45 50.41,8.45 50.85,8 50.85,6.67 IC1.6 | v23.38,8.09 23.38,8.8 24.98,10.4 24.98,13.25 v24.27,13.96 | v13.07,13.96 10.94,16.09 10.4,16.09 U2.1
  Bottom 0.152: v47.3,7.73 29.16,7.73 28.8,7.38 24.09,7.38 v23.38,8.09 | v13.07,13.96 v24.27,13.96
COM_RX  (via drill 0.39)
  Top 0.152: R10.2 19.65,23.74 19.56,23.82 16.54,23.82 TR1.3 16.45,23.82 14.58,23.82 8.98,18.22 v8.98,13.25 | v24.27,11.29 23.91,11.29 23.47,11.73 22.49,11.73 IC2.15
  Bottom 0.152: v8.98,13.25 9.78,13.25 11.47,11.56 24,11.56 v24.27,11.29
COM_TX  (1 unrouted)
COM_TX_5V  (via drill 0.39)
  Top 0.152: v51.47,9.25 IC1.8 | v33.96,14.4 v37.6,10.76 | v13.16,16.18 13.16,17.34 13.34,17.51 U2.30
  Bottom 0.152: v51.47,9.25 51.47,8.09 50.41,7.02 49.87,7.02 49.34,7.56 49.34,8 46.58,10.76 v37.6,10.76 | v33.96,14.4 24.89,14.4 24.54,14.76 17.78,14.76 17.69,14.67 14.67,14.67 v13.16,16.18
D2
  Top 0.152: R6.2 47.38,4.45 47.38,3.91 45.96,2.49 45.96,1.33 45.7,1.07 24.45,1.07 20.98,4.53 19.47,4.53 19.29,4.71 19.29,7.73 20.62,9.07 20.62,14.05 19.82,14.85 19.82,16.45 19.65,16.62 15.65,16.62 14.49,15.47 12.89,15.47 11.82,16.54 11.82,17.51 U2.32
D6  (via drill 0.39)
  Top 0.152: v19.56,9.6 19.11,10.05 13.07,10.05 12.62,9.6 12.62,9.16 U2.10 | v32.36,11.47 32.36,16.8 41.96,26.4 46.49,26.4 47.92,24.98 52.81,24.98 58.76,19.02 58.76,15.73 58.94,15.56 62.59,15.56 63.48,16.45 JP1.4
  Bottom 0.152: v19.56,9.6 26.23,9.6 28.09,7.73 28.63,7.73 v32.36,11.47
D7  (via drill 0.39)
  Top 0.152: v52.27,9.96 53.07,9.16 53.34,9.16 R7.2 | v14.13,7.73 13.42,8.45 13.42,9.07 U2.11
  Bottom 0.152: v52.27,9.96 52.27,8.36 44.27,0.36 21.51,0.36 v14.13,7.73
D13
  Top 0.152: R8.2 8.18,7.02 8.45,7.02 11.91,10.49 18.85,10.49 U2.17
GND  (32 unrouted)
  Top 0.152: X1.GND 60.1,6.84 60.1,8.8 X1.SPRT@2
  pour Bottom: -0.64,35.56 66.04,35.56 66.04,-0.64 -0.64,-0.64
  pour Top: -0.64,35.56 66.04,35.56 66.04,-0.64 -0.64,-0.64
GSM_RF_IN
  Top 0.152: U$2.3 27.91,31.47 27.91,29.25 27.74,29.07 IC2.66
MCU_TX_5V
  Top 0.152: TR1.2 17.42,21.78 17.42,19.74 R11.1 17.34,19.65 16.54,18.85 13.34,18.85 12.62,18.14 12.62,17.6 U2.31
MIC+  (via drill 0.39)
  Top 0.152: 1.69,15.02 C7.2 2.22,15.02 2.22,14.76 v5.78,11.2 | 1.69,15.02 C7.1 | 1.69,18.85 2.13,18.85 C6.2 | 1.69,18.85 1.25,18.85 C6.1 | 1.69,18.85 1.69,15.02 | 1.69,18.85 1.69,33.16 JP5.1 | v25.34,8.8 26.58,7.56 26.58,6.58 IC2.19
  Bottom 0.152: v25.34,8.8 15.11,8.8 12.71,11.2 v5.78,11.2
MIC-  (via drill 0.39)
  Top 0.152: 2.93,16.71 2.22,16.71 C7.7 | 2.93,16.71 2.93,15.11 C7.3 | 2.93,16.71 C7.6 3.02,16.71 3.82,16.71 C7.5 3.82,16.8 3.82,18.76 C6.4 3.82,18.85 3.02,18.85 C6.3 2.93,18.85 2.93,20.45 C6.6 | C6.6 2.22,20.54 C6.7 | v27.65,9.87 27.65,6.58 IC2.20 | C6.6 2.93,25.25 3.02,25.34 Q1.- 3.11,25.43 4.18,26.49 4.18,33.16 JP5.2
  Bottom 0.152: v27.65,9.87 27.2,9.87 24.45,12.62 12.27,12.62 4.36,20.54 4.36,24.09 3.11,25.34 Q1.-
N$1
  Top 0.152: R8.1 6.4,7.02 5.96,7.02 3.29,9.69 1.96,9.69 LED4.A
N$2
  Top 0.152: R4.1 6.4,1.96 6.4,2.49 JP2.2 4.45,4.36 2.22,2.13 1.96,2.13 LED2.A
N$3
  Top 0.152: D5.C 49.34,0.71 49.34,1.51 48.81,2.04 48.81,4.18 49.07,4.45 R6.1 48.9,4.36 48.09,5.16 47.83,5.16 46.05,6.93 46.05,7.47 47.38,8.8 50.58,8.8 51.12,8.27 58.05,8.27 58.85,7.47 58.85,6.31 59.56,5.6 60.1,5.6 X1.D+
N$4
  Top 0.152: R3.1 6.4,4.45 6.4,4.98 4.45,6.93 JP2.1 4.45,6.84 3.56,5.96 1.96,5.96 LED1.A
N$5  (via drill 0.39)
  Top 0.152: 53.34,7.47 52.32,6.45 | 52.32,6.45 51.74,5.87 51.47,5.87 50.05,4.45 50.05,4 49.43,3.38 49.43,2.58 D3.C | 53.34,7.47 55.21,7.47 R9.1 | 53.34,7.47 R7.1 | v55.03,17.96 59.3,13.69 61.16,13.69 62.41,12.45 62.41,11.47 62.94,10.94 63.92,10.94 64.36,10.49 64.36,7.82 64.19,7.64 62.5,7.64 61.7,6.84 61.7,5.87 60.72,4.89 60.19,4.89 X1.D- | v51.65,22.23 50.94,22.23 49.61,23.56 v49.43,23.56 | v43.03,10.05 v43.03,20.09 | v48.01,10.94 v45.78,8.71 | v52.27,6.49 52.32,6.45
  Bottom 0.152: v55.03,17.96 55.03,18.85 v51.65,22.23 | v49.43,23.56 47.12,23.56 43.65,20.09 v43.03,20.09 | v43.03,10.05 44.45,10.05 v45.78,8.71 | v48.01,10.94 52.27,10.94 52.98,10.22 52.98,7.2 v52.27,6.49
N$6
  Top 0.152: LED3.A 61.52,11.82 58.94,11.82 R5.1 58.85,11.82 58.85,10.67 57.78,9.6 JP3.1
N$7
  Top 0.152: L1.1 33.87,3.11 31.47,3.11 R14.2 31.38,3.11 30.49,4 28.8,4 28,3.2 27.29,3.2 C12.2
N$8
  Top 0.152: 15.65,19.74 15.65,21.78 TR1.1 | 15.65,19.74 13.6,19.74 R12.1 | 15.65,19.74 R11.2
N$9
  Top 0.152: U$1.3 43.74,4 41.16,4 40.36,3.2 C11.1 40.27,3.2 39.29,4.18 37.69,4.18 36.72,3.2 36.01,3.2 L1.2
N$10  (via drill 0.39)
  Top 0.152: v39.83,1.78 38.49,3.11 C11.2 | v43.74,6.49 43.74,8.62 44.9,9.78 IC2.35
  Bottom 0.152: v39.83,1.78 39.83,2.58 v43.74,6.49
N$11
  Top 0.152: C10.1 20.36,5.42 20.36,7.73 IC2.17
NETSTAT_5V  (via drill 0.39)
  Top 0.152: v24.98,4.62 42.85,4.62 44.45,6.22 44.45,6.4 49.52,11.47 49.52,12.45 IC1.11 | v7.82,3.02 7.82,2.22 8.09,1.96 R4.2
  Bottom 0.152: v24.98,4.62 18.76,4.62 14.58,8.8 10.85,8.8 7.82,5.78 v7.82,3.02
PWRKEY  (via drill 0.39)
  Top 0.152: 52.27,17.42 52.27,18.49 B2.B | 52.27,17.42 52.27,14.49 B2.B' | v52.18,17.42 52.27,17.42 | v25.6,18.85 22.49,18.85 IC2.8
  Bottom 0.152: v52.18,17.42 52.18,20.71 50.14,22.76 50.14,23.82 49.7,24.27 47.3,24.27 43.83,20.8 27.56,20.8 v25.6,18.85
PWRSTAT_5V  (via drill 0.39)
  Top 0.152: v48.36,7.73 48.81,7.29 48.81,6.67 IC1.3 | v8.89,3.29 8.89,3.73 R3.2
  Bottom 0.152: v48.36,7.73 47.65,7.02 44.18,7.02 44.01,7.2 29.16,7.2 25.87,3.91 18.94,3.91 14.4,8.45 11.02,8.45 8.89,6.31 v8.89,3.29
RESET  (via drill 0.39)
  Top 0.152: 52.27,21.51 52.27,21.87 52.36,21.96 52.36,24.18 52.27,24.27 B1.B | 52.27,21.51 52.27,20.18 B1.B' | 47.7,22.8 47.74,22.85 49.78,22.85 51.12,21.51 52.27,21.51 | 47.7,22.8 47.47,22.58 47.47,21.43 48.18,20.71 48.18,19.91 R2.1 | v14.22,16.18 14.22,17.51 U2.29 | v46.76,24.71 46.76,23.74 47.7,22.8
  Bottom 0.152: v14.22,16.18 21.96,16.18 30.49,24.71 v46.76,24.71
RTS
  Top 0.152: R13.2 19.74,18.14 19.74,17.07 20.89,15.91 20.89,14.31 21.34,13.87 22.4,13.87 IC2.13
SIM_CLK  (via drill 0.39)
  Top 0.152: v46.76,13.69 46.85,13.78 49.25,13.78 49.52,14.05 49.52,14.67 49.07,15.11 49.07,16.09 D4.4 | v38.94,13.69 39.12,13.51 39.12,11.2 38.67,10.76 38.67,6.58 IC2.31
  Bottom 0.152: v46.76,13.69 v38.94,13.69 28,13.69 27.83,13.51 X2.C3
SIM_DATA  (via drill 0.39)
  Top 0.152: v50.32,16.62 48.63,16.62 48.54,16.54 48.54,16.45 48.27,16.18 D4.5 | v41.96,19.38 41.6,19.02 41.6,10.76 42.32,10.05 42.32,5.25 42.14,5.07 38.14,5.07 37.69,5.51 37.69,6.49 IC2.30
  Bottom 0.152: X2.C7 53.43,13.51 v50.32,16.62 50.41,16.62 50.58,16.8 50.58,21.69 50.14,22.14 49.61,22.14 46.85,19.38 v41.96,19.38
SIM_RST  (via drill 0.39)
  Top 0.152: v48.18,15.2 48.98,14.4 D4.3 | v39.65,15.2 39.65,6.58 IC2.32
  Bottom 0.152: v48.18,15.2 v39.65,15.2 28.54,15.2 27.83,15.91 X2.C2
SIM_VDD  (via drill 0.39)
  Top 0.356: v46.76,16.8 46.76,15.47 47.47,14.76 47.47,14.4 D4.1 | v34.67,18.14 33.16,16.62 33.16,14.05 36.63,10.58 36.63,6.58 IC2.29
  Bottom 0.356: v46.76,16.8 46.49,16.8 44.81,18.49 34.67,18.49 | 34.67,18.49 27.83,18.49 X2.C1 | 34.67,18.49 v34.67,18.14
SPK+  (via drill 0.39)
  Top 0.152: 6.13,15.02 C9.2 6.67,15.02 6.67,14.76 v7.47,13.96 | 6.13,15.02 C9.1 | 6.13,18.85 6.58,18.85 C8.2 | 6.13,18.85 5.69,18.85 C8.1 | 6.13,18.85 6.13,15.02 | 6.13,18.85 6.13,32.54 6.76,33.16 JP5.3 | v28.36,8.45 28.63,8.18 28.63,6.58 IC2.21
  Bottom 0.152: v28.36,8.45 28.09,8.45 24.27,12.27 11.29,12.27 9.6,13.96 v7.47,13.96
SPK-
  Top 0.152: 7.38,16.71 7.38,15.11 C9.3 | 7.38,16.71 6.67,16.71 C9.7 | 7.38,16.71 C9.6 7.47,16.71 8.27,16.71 C9.5 8.27,16.8 8.27,18.76 C8.4 | C8.7 6.67,20.54 7.38,20.54 C8.6 7.38,20.45 7.38,18.85 C8.3 7.47,18.85 8.27,18.85 C8.4 | 13.56,24.05 8.36,18.85 C8.4 | 13.56,24.05 14.13,24.62 17.25,24.62 19.02,26.4 24.54,26.4 30.76,20.18 30.76,16.36 29.69,15.29 29.69,6.58 IC2.22 | JP5.4 9.34,31.56 8.89,31.11 8.89,28.71 13.56,24.05
VBAT  (via drill 0.39)
  Top 0.356: IC2.6 22.4,20.8 22.4,21.69 IC2.5 22.4,21.87 22.4,22.76 IC2.4 22.58,22.76 v27.2,22.76 | D1.C 50.67,28.54 50.67,26.23 50.49,26.05 C2.1 | D1.C 50.76,28.27 53.96,28.27 C3.1 54.14,28.27 57.34,31.47 62.5,31.47 JP4.2 | 48.45,30.94 48.45,31.74 C1.1 | 48.45,30.94 50.67,28.71 D1.C | v45.7,29.07 47.47,30.85 48.36,30.85 48.45,30.94
  Bottom 0.356: v27.2,22.76 27.83,22.76 34.14,29.07 v45.7,29.07
VBUS  (via drill 0.39)
  Top 0.356: 58.85,4.27 58.5,4.27 57.78,4.98 D2.A | 58.85,4.27 60.1,4.27 X1.VBUS | v58.85,3.82 58.85,4.27 | v60.19,14.76 v62.05,14.76 | v53.07,21.96 v57.25,17.78 | v40.09,25.51 40.09,25.25 31.56,16.71 31.56,8.71 32.63,7.64 32.63,6.58 IC2.25
  Bottom 0.356: v58.85,3.82 60.1,3.82 63.83,7.56 64.28,7.56 64.45,7.73 64.45,11.38 62.05,13.78 v62.05,14.76 | v60.19,14.76 59.56,14.76 57.25,17.07 v57.25,17.78 | v53.07,21.96 49.52,25.51 v40.09,25.51
VDD_EXT
  Top 0.356: R10.1 19.74,21.96 19.74,19.91 R13.1 19.91,19.91 22.31,19.91 IC2.7 22.49,19.74 27.38,19.74 30.05,17.07 30.05,16.36 29.16,15.47 29.16,13.87 24.18,8.89 24.18,2.49 24.62,2.04 28,2.04 28.98,3.02 29.43,3.02 R14.1
VIB  (via drill 0.39)
  Top 0.152: v3.65,23.2 4.36,22.49 4.36,15.38 7.29,12.45 7.29,6.49 7.56,6.22 8.8,6.22 10.13,7.56 10.22,7.56 11.73,9.07 U2.9
  Bottom 0.152: v3.65,23.2 1.96,24.89 1.96,25.87 2.58,26.49 17.78,26.49 S1.2

### Text on the board
tPlace: MIC | SPK | 12V | GND | ALM | D6 | A0 | PWR | LED | COM | NET